# Altium schematic sheet KeyMatrix.SchDoc
size A4; Organization: Altium Limited; Address1: L3, 12a Rodborough Rd; Address2: Frenchs Forest; Address3: NSW; Address4: Australia 2086
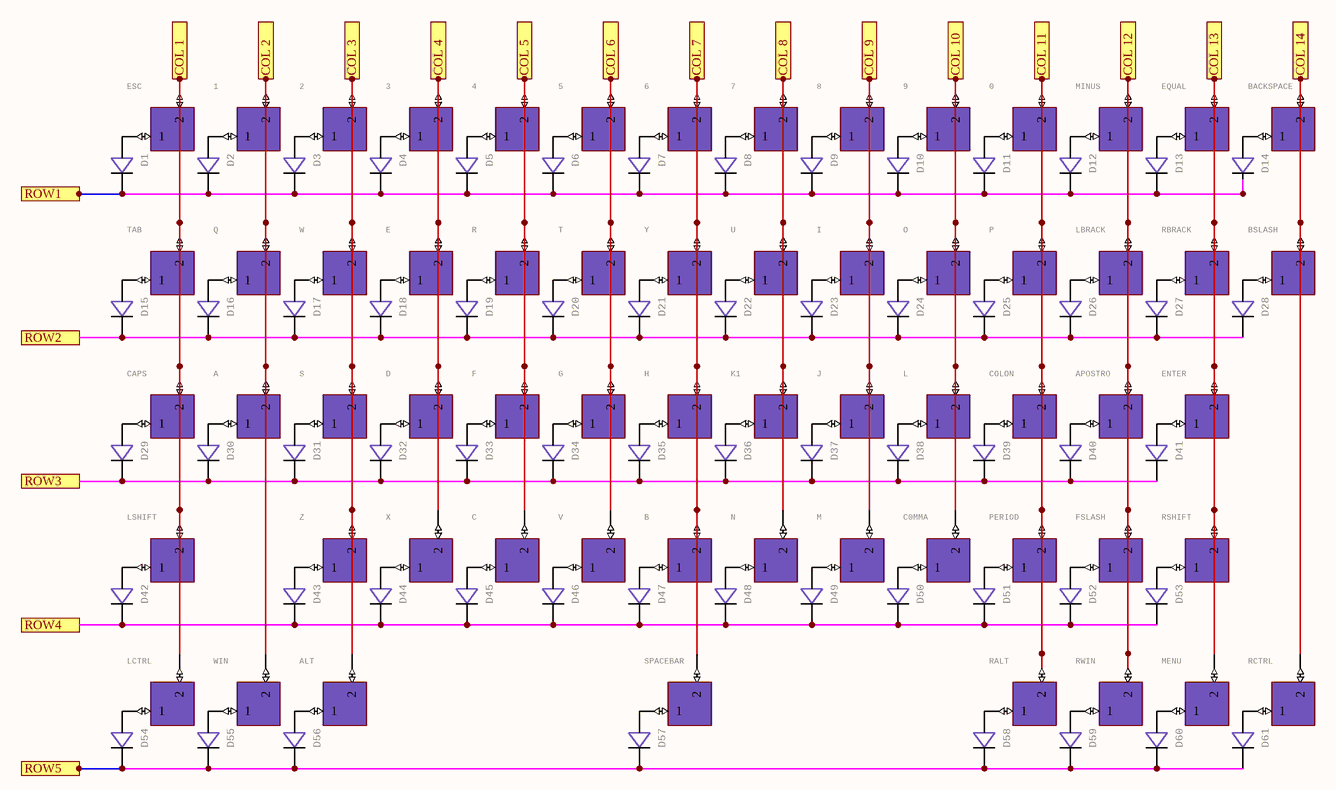
[diagram p0: KeyMatrix.SchDoc]

## Parts
0  KEYSWITCH-PLAIN-MXHSPCB-1U  [MXHSPCB-1U]  (value not drawn)
1  KEYSWITCH-PLAIN-MXHSPCB-1U  [MXHSPCB-1U]  (value not drawn)
2  KEYSWITCH-PLAIN-MXHSPCB-1U  [MXHSPCB-1U]  (value not drawn)
3  KEYSWITCH-PLAIN-MXHSPCB-1U  [MXHSPCB-1U]  (value not drawn)
4  KEYSWITCH-PLAIN-MXHSPCB-1U  [MXHSPCB-1U]  (value not drawn)
5  KEYSWITCH-PLAIN-MXHSPCB-1U  [MXHSPCB-1U]  (value not drawn)
6  KEYSWITCH-PLAIN-MXHSPCB-1U  [MXHSPCB-1U]  (value not drawn)
7  KEYSWITCH-PLAIN-MXHSPCB-1U  [MXHSPCB-1U]  (value not drawn)
8  KEYSWITCH-PLAIN-MXHSPCB-1U  [MXHSPCB-1U]  (value not drawn)
9  KEYSWITCH-PLAIN-MXHSPCB-1U  [MXHSPCB-1U]  (value not drawn)
A  KEYSWITCH-PLAIN-MXHSPCB-1U  [MXHSPCB-1U]  (value not drawn)
ALT  KEYSWITCH-PLAIN-MXHSPCB-1U  [MXHSPCB-1U]  (value not drawn)
APOSTRO  KEYSWITCH-PLAIN-MXHSPCB-1U  [MXHSPCB-1U]  (value not drawn)
B  KEYSWITCH-PLAIN-MXHSPCB-1U  [MXHSPCB-1U]  (value not drawn)
BACKSPACE  KEYSWITCH-PLAIN-MXHSPCB-2U  [MXHSPCB-2U-LEDHOLE]  (value not drawn)
BSLASH  KEYSWITCH-PLAIN-MXHSPCB-1U  [MXHSPCB-1U]  (value not drawn)
C  KEYSWITCH-PLAIN-MXHSPCB-1U  [MXHSPCB-1U]  (value not drawn)
C0MMA  KEYSWITCH-PLAIN-MXHSPCB-1U  [MXHSPCB-1U]  (value not drawn)
CAPS  KEYSWITCH-PLAIN-MXHSPCB-1U  [MXHSPCB-1U]  (value not drawn)
COLON  KEYSWITCH-PLAIN-MXHSPCB-1U  [MXHSPCB-1U]  (value not drawn)
D  KEYSWITCH-PLAIN-MXHSPCB-1U  [MXHSPCB-1U]  (value not drawn)
D1  Standard 1N4148 diode  [SOD-123]  (value not drawn)
D2  Standard 1N4148 diode  [SOD-123]  (value not drawn)
D3  Standard 1N4148 diode  [SOD-123]  (value not drawn)
D4  Standard 1N4148 diode  [SOD-123]  (value not drawn)
D5  Standard 1N4148 diode  [SOD-123]  (value not drawn)
D6  Standard 1N4148 diode  [SOD-123]  (value not drawn)
D7  Standard 1N4148 diode  [SOD-123]  (value not drawn)
D8  Standard 1N4148 diode  [SOD-123]  (value not drawn)
D9  Standard 1N4148 diode  [SOD-123]  (value not drawn)
D10  Standard 1N4148 diode  [SOD-123]  (value not drawn)
D11  Standard 1N4148 diode  [SOD-123]  (value not drawn)
D12  Standard 1N4148 diode  [SOD-123]  (value not drawn)
D13  Standard 1N4148 diode  [SOD-123]  (value not drawn)
D14  Standard 1N4148 diode  [SOD-123]  (value not drawn)
D15  Standard 1N4148 diode  [SOD-123]  (value not drawn)
D16  Standard 1N4148 diode  [SOD-123]  (value not drawn)
D17  Standard 1N4148 diode  [SOD-123]  (value not drawn)
D18  Standard 1N4148 diode  [SOD-123]  (value not drawn)
D19  Standard 1N4148 diode  [SOD-123]  (value not drawn)
D20  Standard 1N4148 diode  [SOD-123]  (value not drawn)
D21  Standard 1N4148 diode  [SOD-123]  (value not drawn)
D22  Standard 1N4148 diode  [SOD-123]  (value not drawn)
D23  Standard 1N4148 diode  [SOD-123]  (value not drawn)
D24  Standard 1N4148 diode  [SOD-123]  (value not drawn)
D25  Standard 1N4148 diode  [SOD-123]  (value not drawn)
D26  Standard 1N4148 diode  [SOD-123]  (value not drawn)
D27  Standard 1N4148 diode  [SOD-123]  (value not drawn)
D28  Standard 1N4148 diode  [SOD-123]  (value not drawn)
D29  Standard 1N4148 diode  [SOD-123]  (value not drawn)
D30  Standard 1N4148 diode  [SOD-123]  (value not drawn)
D31  Standard 1N4148 diode  [SOD-123]  (value not drawn)
D32  Standard 1N4148 diode  [SOD-123]  (value not drawn)
D33  Standard 1N4148 diode  [SOD-123]  (value not drawn)
D34  Standard 1N4148 diode  [SOD-123]  (value not drawn)
D35  Standard 1N4148 diode  [SOD-123]  (value not drawn)
D36  Standard 1N4148 diode  [SOD-123]  (value not drawn)
D37  Standard 1N4148 diode  [SOD-123]  (value not drawn)
D38  Standard 1N4148 diode  [SOD-123]  (value not drawn)
D39  Standard 1N4148 diode  [SOD-123]  (value not drawn)
D40  Standard 1N4148 diode  [SOD-123]  (value not drawn)
D41  Standard 1N4148 diode  [SOD-123]  (value not drawn)
D42  Standard 1N4148 diode  [SOD-123]  (value not drawn)
D43  Standard 1N4148 diode  [SOD-123]  (value not drawn)
D44  Standard 1N4148 diode  [SOD-123]  (value not drawn)
D45  Standard 1N4148 diode  [SOD-123]  (value not drawn)
D46  Standard 1N4148 diode  [SOD-123]  (value not drawn)
D47  Standard 1N4148 diode  [SOD-123]  (value not drawn)
D48  Standard 1N4148 diode  [SOD-123]  (value not drawn)
D49  Standard 1N4148 diode  [SOD-123]  (value not drawn)
D50  Standard 1N4148 diode  [SOD-123]  (value not drawn)
D51  Standard 1N4148 diode  [SOD-123]  (value not drawn)
D52  Standard 1N4148 diode  [SOD-123]  (value not drawn)
D53  Standard 1N4148 diode  [SOD-123]  (value not drawn)
D54  Standard 1N4148 diode  [SOD-123]  (value not drawn)
D55  Standard 1N4148 diode  [SOD-123]  (value not drawn)
D56  Standard 1N4148 diode  [SOD-123]  (value not drawn)
D57  Standard 1N4148 diode  [SOD-123]  (value not drawn)
D58  Standard 1N4148 diode  [SOD-123]  (value not drawn)
D59  Standard 1N4148 diode  [SOD-123]  (value not drawn)
D60  Standard 1N4148 diode  [SOD-123]  (value not drawn)
D61  Standard 1N4148 diode  [SOD-123]  (value not drawn)
E  KEYSWITCH-PLAIN-MXHSPCB-1U  [MXHSPCB-1U]  (value not drawn)
ENTER  KEYSWITCH-PLAIN-MXHSPCB-2U  [MXHSPCB-2U-LEDHOLE]  (value not drawn)
EQUAL  KEYSWITCH-PLAIN-MXHSPCB-1U  [MXHSPCB-1U]  (value not drawn)
ESC  KEYSWITCH-PLAIN-MXHSPCB-1U  [MXHSPCB-1U]  (value not drawn)
F  KEYSWITCH-PLAIN-MXHSPCB-1U  [MXHSPCB-1U]  (value not drawn)
FSLASH  KEYSWITCH-PLAIN-MXHSPCB-1U  [MXHSPCB-1U]  (value not drawn)
G  KEYSWITCH-PLAIN-MXHSPCB-1U  [MXHSPCB-1U]  (value not drawn)
H  KEYSWITCH-PLAIN-MXHSPCB-1U  [MXHSPCB-1U]  (value not drawn)
I  KEYSWITCH-PLAIN-MXHSPCB-1U  [MXHSPCB-1U]  (value not drawn)
J  KEYSWITCH-PLAIN-MXHSPCB-1U  [MXHSPCB-1U]  (value not drawn)
K1  KEYSWITCH-PLAIN-MXHSPCB-1U  [MXHSPCB-1U]  (value not drawn)
L  KEYSWITCH-PLAIN-MXHSPCB-1U  [MXHSPCB-1U]  (value not drawn)
LBRACK  KEYSWITCH-PLAIN-MXHSPCB-1U  [MXHSPCB-1U]  (value not drawn)
LCTRL  KEYSWITCH-PLAIN-MXHSPCB-1U  [MXHSPCB-1U]  (value not drawn)
LSHIFT  KEYSWITCH-PLAIN-MXHSPCB-2U  [MXHSPCB-2U-LEDHOLE]  (value not drawn)
M  KEYSWITCH-PLAIN-MXHSPCB-1U  [MXHSPCB-1U]  (value not drawn)
MENU  KEYSWITCH-PLAIN-MXHSPCB-1U  [MXHSPCB-1U]  (value not drawn)
MINUS  KEYSWITCH-PLAIN-MXHSPCB-1U  [MXHSPCB-1U]  (value not drawn)
N  KEYSWITCH-PLAIN-MXHSPCB-1U  [MXHSPCB-1U]  (value not drawn)
O  KEYSWITCH-PLAIN-MXHSPCB-1U  [MXHSPCB-1U]  (value not drawn)
P  KEYSWITCH-PLAIN-MXHSPCB-1U  [MXHSPCB-1U]  (value not drawn)
PERIOD  KEYSWITCH-PLAIN-MXHSPCB-1U  [MXHSPCB-1U]  (value not drawn)
Q  KEYSWITCH-PLAIN-MXHSPCB-1U  [MXHSPCB-1U]  (value not drawn)
R  KEYSWITCH-PLAIN-MXHSPCB-1U  [MXHSPCB-1U]  (value not drawn)
RALT  KEYSWITCH-PLAIN-MXHSPCB-1U  [MXHSPCB-1U]  (value not drawn)
RBRACK  KEYSWITCH-PLAIN-MXHSPCB-1U  [MXHSPCB-1U]  (value not drawn)
RCTRL  KEYSWITCH-PLAIN-MXHSPCB-1U  [MXHSPCB-1U]  (value not drawn)
RSHIFT  KEYSWITCH-PLAIN-MXHSPCB-2U  [MXHSPCB-2U-LEDHOLE]  (value not drawn)
RWIN  KEYSWITCH-PLAIN-MXHSPCB-1U  [MXHSPCB-1U]  (value not drawn)
S  KEYSWITCH-PLAIN-MXHSPCB-1U  [MXHSPCB-1U]  (value not drawn)
SPACEBAR  KEYSWITCH-PLAIN-MXHSPCB-6.25U  [MXHSPCB-6.25U-FLIPPED]  (value not drawn)
T  KEYSWITCH-PLAIN-MXHSPCB-1U  [MXHSPCB-1U]  (value not drawn)
TAB  KEYSWITCH-PLAIN-MXHSPCB-1U  [MXHSPCB-1U]  (value not drawn)
U  KEYSWITCH-PLAIN-MXHSPCB-1U  [MXHSPCB-1U]  (value not drawn)
V  KEYSWITCH-PLAIN-MXHSPCB-1U  [MXHSPCB-1U]  (value not drawn)
W  KEYSWITCH-PLAIN-MXHSPCB-1U  [MXHSPCB-1U]  (value not drawn)
WIN  KEYSWITCH-PLAIN-MXHSPCB-1U  [MXHSPCB-1U]  (value not drawn)
X  KEYSWITCH-PLAIN-MXHSPCB-1U  [MXHSPCB-1U]  (value not drawn)
Y  KEYSWITCH-PLAIN-MXHSPCB-1U  [MXHSPCB-1U]  (value not drawn)
Z  KEYSWITCH-PLAIN-MXHSPCB-1U  [MXHSPCB-1U]  (value not drawn)

## Ports
COL 1, COL 2, COL 3, COL 4, COL 5, COL 6, COL 7, COL 8, COL 9, COL 10, COL 11, COL 12, COL 13, COL 14, ROW1, ROW2, ROW3, ROW4, ROW5

## Nets
COL 1: CAPS.MX2(2) ESC.MX2(2) LCTRL.MX2(2) LSHIFT.MX2(2) TAB.MX2(2) ; port COL 1
COL 2: 1.MX2(2) A.MX2(2) Q.MX2(2) WIN.MX2(2) ; port COL 2
COL 3: 2.MX2(2) ALT.MX2(2) S.MX2(2) W.MX2(2) Z.MX2(2) ; port COL 3
COL 4: 3.MX2(2) D.MX2(2) E.MX2(2) X.MX2(2) ; port COL 4
COL 5: 4.MX2(2) C.MX2(2) F.MX2(2) R.MX2(2) ; port COL 5
COL 6: 5.MX2(2) G.MX2(2) T.MX2(2) V.MX2(2) ; port COL 6
COL 7: 6.MX2(2) B.MX2(2) H.MX2(2) SPACEBAR.MX2(2) Y.MX2(2) ; port COL 7
COL 8: 7.MX2(2) K1.MX2(2) N.MX2(2) U.MX2(2) ; port COL 8
COL 9: 8.MX2(2) I.MX2(2) J.MX2(2) M.MX2(2) ; port COL 9
COL 10: 9.MX2(2) C0MMA.MX2(2) L.MX2(2) O.MX2(2) ; port COL 10
COL 11: 0.MX2(2) COLON.MX2(2) P.MX2(2) PERIOD.MX2(2) RALT.MX2(2) ; port COL 11
COL 12: APOSTRO.MX2(2) FSLASH.MX2(2) LBRACK.MX2(2) MINUS.MX2(2) RWIN.MX2(2) ; port COL 12
COL 13: ENTER.MX2(2) EQUAL.MX2(2) MENU.MX2(2) RBRACK.MX2(2) RSHIFT.MX2(2) ; port COL 13
COL 14: BACKSPACE.MX2(2) BSLASH.MX2(2) RCTRL.MX2(2) ; port COL 14
ROW1: D1.C D2.C D3.C D4.C D5.C D6.C D7.C D8.C D9.C D10.C D11.C D12.C D13.C D14.C ; port ROW1
ROW2: D15.C D16.C D17.C D18.C D19.C D20.C D21.C D22.C D23.C D24.C D25.C D26.C D27.C D28.C ; port ROW2
ROW3: D29.C D30.C D31.C D32.C D33.C D34.C D35.C D36.C D37.C D38.C D39.C D40.C D41.C ; port ROW3
ROW4: D42.C D43.C D44.C D45.C D46.C D47.C D48.C D49.C D50.C D51.C D52.C D53.C ; port ROW4
ROW5: D54.C D55.C D56.C D57.C D58.C D59.C D60.C D61.C ; port ROW5
Net0_MX1: 0.MX1(1) D11.A
Net1_MX1: 1.MX1(1) D2.A
Net2_MX1: 2.MX1(1) D3.A
Net3_MX1: 3.MX1(1) D4.A
Net4_MX1: 4.MX1(1) D5.A
Net5_MX1: 5.MX1(1) D6.A
Net6_MX1: 6.MX1(1) D7.A
Net7_MX1: 7.MX1(1) D8.A
Net8_MX1: 8.MX1(1) D9.A
Net9_MX1: 9.MX1(1) D10.A
NetA_MX1: A.MX1(1) D30.A
NetALT_MX1: ALT.MX1(1) D56.A
NetAPOSTRO_MX1: APOSTRO.MX1(1) D40.A
NetB_MX1: B.MX1(1) D47.A
NetBACKSPACE_MX1: BACKSPACE.MX1(1) D14.A
NetBSLASH_MX1: BSLASH.MX1(1) D28.A
NetC0MMA_MX1: C0MMA.MX1(1) D50.A
NetC_MX1: C.MX1(1) D45.A
NetCAPS_MX1: CAPS.MX1(1) D29.A
NetCOLON_MX1: COLON.MX1(1) D39.A
NetD1_A: D1.A ESC.MX1(1)
NetD12_A: D12.A MINUS.MX1(1)
NetD13_A: D13.A EQUAL.MX1(1)
NetD15_A: D15.A TAB.MX1(1)
NetD16_A: D16.A Q.MX1(1)
NetD17_A: D17.A W.MX1(1)
NetD18_A: D18.A E.MX1(1)
NetD19_A: D19.A R.MX1(1)
NetD20_A: D20.A T.MX1(1)
NetD21_A: D21.A Y.MX1(1)
NetD22_A: D22.A U.MX1(1)
NetD23_A: D23.A I.MX1(1)
NetD24_A: D24.A O.MX1(1)
NetD25_A: D25.A P.MX1(1)
NetD26_A: D26.A LBRACK.MX1(1)
NetD27_A: D27.A RBRACK.MX1(1)
NetD31_A: D31.A S.MX1(1)
NetD33_A: D33.A F.MX1(1)
NetD34_A: D34.A G.MX1(1)
NetD35_A: D35.A H.MX1(1)
NetD36_A: D36.A K1.MX1(1)
NetD37_A: D37.A J.MX1(1)
NetD38_A: D38.A L.MX1(1)
NetD41_A: D41.A ENTER.MX1(1)
NetD42_A: D42.A LSHIFT.MX1(1)
NetD43_A: D43.A Z.MX1(1)
NetD44_A: D44.A X.MX1(1)
NetD46_A: D46.A V.MX1(1)
NetD48_A: D48.A N.MX1(1)
NetD49_A: D49.A M.MX1(1)
NetD51_A: D51.A PERIOD.MX1(1)
NetD52_A: D52.A FSLASH.MX1(1)
NetD53_A: D53.A RSHIFT.MX1(1)
NetD54_A: D54.A LCTRL.MX1(1)
NetD55_A: D55.A WIN.MX1(1)
NetD57_A: D57.A SPACEBAR.MX1(1)
NetD58_A: D58.A RALT.MX1(1)
NetD59_A: D59.A RWIN.MX1(1)
NetD60_A: D60.A MENU.MX1(1)
NetD61_A: D61.A RCTRL.MX1(1)
NetD_MX1: D.MX1(1) D32.A

## Notes on the sheet
- Title
- Size:
- Date:
- A4
- Number:
- Time:
- Revision:
- Sheet
- of
- File:

## Library data of the parts
0-9 A ALT APOSTRO B BSLASH C C0MMA CAPS COLON D E EQUAL ESC F FSLASH G H I J K1 L LBRACK LCTRL M MENU MINUS N O P PERIOD Q R RALT RBRACK RCTRL RWIN S T TAB U V W WIN X Y Z = KEYSWITCH-PLAIN-MXHSPCB-1U: GateName_1: G$1; SymbolName_1: KEYSWITCH-PLAIN; DeviceName: -MXHSPCB-1U; LibraryName: Keyboard; DeviceSetName: KEYSWITCH-PLAIN; Package: MXHSPCB-1U
BACKSPACE ENTER LSHIFT RSHIFT = KEYSWITCH-PLAIN-MXHSPCB-2U: DeviceName: -MXHSPCB-1U; GateName_1: G$1; SymbolName_1: KEYSWITCH-PLAIN; LibraryName: Keyboard; DeviceSetName: KEYSWITCH-PLAIN; Package: MXHSPCB-1U
D1-D61 = DIODE-SOD-123: GateName_1: D$1; SymbolName_1: DIODE; DeviceName: -SOD-123; LibraryName: Components; DeviceSetName: DIODE; Package: SOD-123
SPACEBAR = KEYSWITCH-PLAIN-MXHSPCB-6.25U: DeviceName: -MXHSPCB-1U; GateName_1: G$1; SymbolName_1: KEYSWITCH-PLAIN; LibraryName: Keyboard; DeviceSetName: KEYSWITCH-PLAIN; Package: MXHSPCB-1U